# EAGLE schematic USB-C_PURE_v1 (EAGLE 9.7.0)

## Sheet 1 of 2
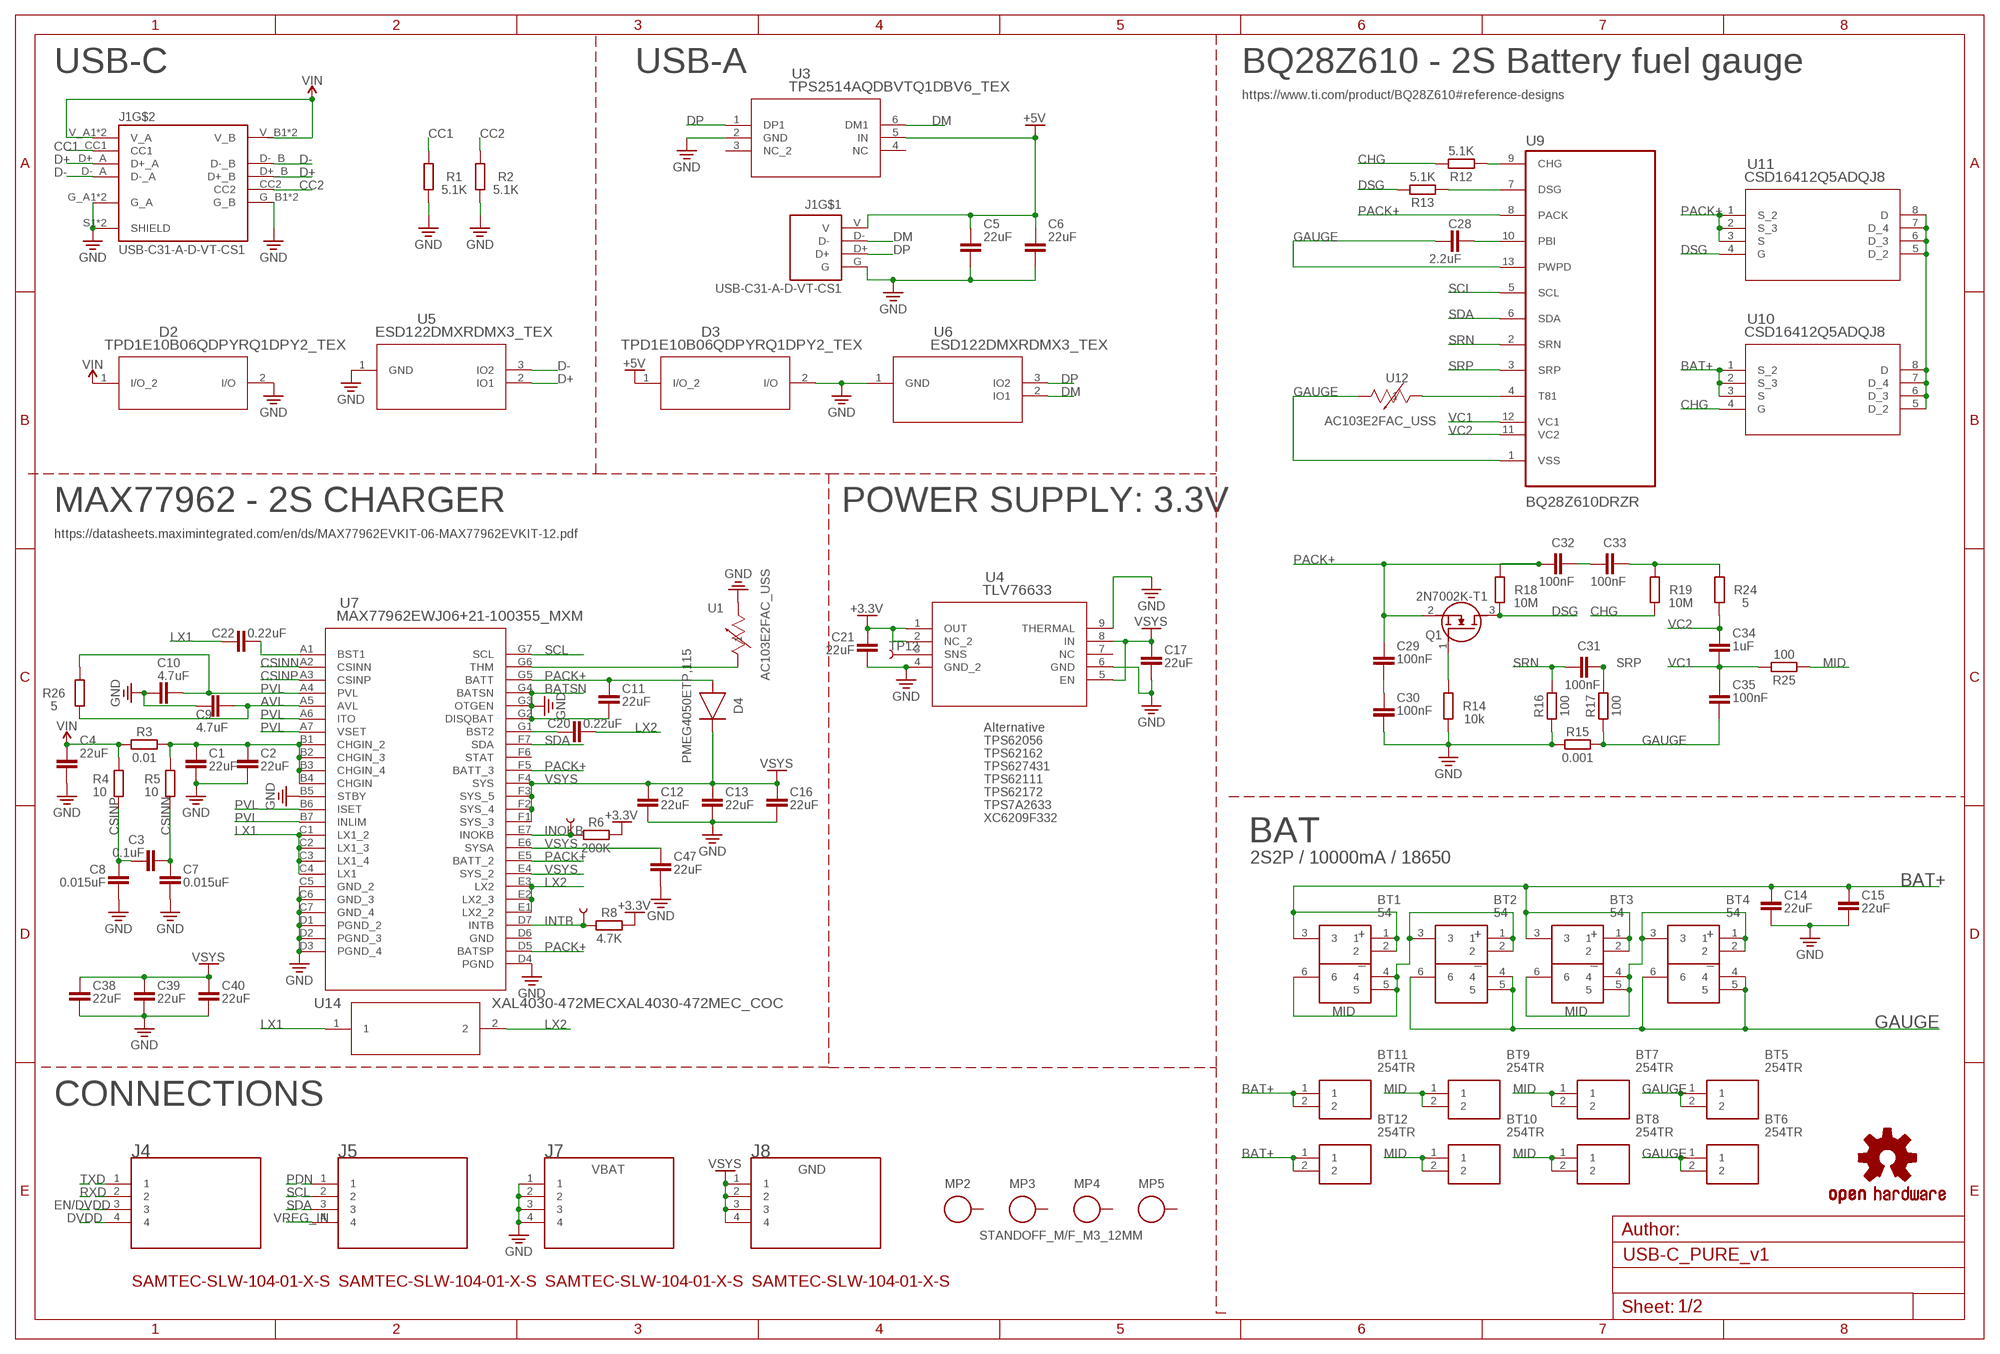
[diagram p0: schematic, sheet 1]

### Parts
BT1  54  [54]
BT2  54  [54]
BT3  54  [54]
BT4  54  [54]
BT5  254TR  [254TR]
BT6  254TR  [254TR]
BT7  254TR  [254TR]
BT8  254TR  [254TR]
BT9  254TR  [254TR]
BT10  254TR  [254TR]
BT11  254TR  [254TR]
BT12  254TR  [254TR]
C1  22uF  C_CHIP-0805(2012-METRIC)  [CAPC2012X110]
C2  22uF  C_CHIP-0805(2012-METRIC)  [CAPC2012X110]
C3  0.1uF  C_CHIP-0603(1608-METRIC)  [CAPC1608X85]
C4  22uF  C_CHIP-0805(2012-METRIC)  [CAPC2012X110]
C5  22uF  C_CHIP-0805(2012-METRIC)  [CAPC2012X110]
C6  22uF  C_CHIP-0805(2012-METRIC)  [CAPC2012X110]
C7  0.015uF  C_CHIP-0603(1608-METRIC)  [CAPC1608X85]
C8  0.015uF  C_CHIP-0603(1608-METRIC)  [CAPC1608X85]
C9  4.7uF  C_CHIP-0603(1608-METRIC)  [CAPC1608X85]
C10  4.7uF  C_CHIP-0603(1608-METRIC)  [CAPC1608X85]
C11  22uF  C_CHIP-0805(2012-METRIC)  [CAPC2012X110]
C12  22uF  C_CHIP-0805(2012-METRIC)  [CAPC2012X110]
C13  22uF  C_CHIP-0805(2012-METRIC)  [CAPC2012X110]
C14  22uF  C_CHIP-0805(2012-METRIC)  [CAPC2012X110]
C15  22uF  C_CHIP-0805(2012-METRIC)  [CAPC2012X110]
C16  22uF  C_CHIP-0805(2012-METRIC)  [CAPC2012X110]
C17  22uF  C_CHIP-0805(2012-METRIC)  [CAPC2012X110]
C20  0.22uF  C_CHIP-0603(1608-METRIC)  [CAPC1608X85]
C21  22uF  C_CHIP-0805(2012-METRIC)  [CAPC2012X110]
C22  0.22uF  C_CHIP-0603(1608-METRIC)  [CAPC1608X85]
C28  2.2uF  C_CHIP-0805(2012-METRIC)  [CAPC2012X110]
C29  100nF  C_CHIP-0402(1005-METRIC)  [CAPC1005X60]
C30  100nF  C_CHIP-0402(1005-METRIC)  [CAPC1005X60]
C31  100nF  C_CHIP-0402(1005-METRIC)  [CAPC1005X60]
C32  100nF  C_CHIP-0402(1005-METRIC)  [CAPC1005X60]
C33  100nF  C_CHIP-0402(1005-METRIC)  [CAPC1005X60]
C34  1uF  C_CHIP-0402(1005-METRIC)  [CAPC1005X60]
C35  100nF  C_CHIP-0402(1005-METRIC)  [CAPC1005X60]
C38  22uF  C_CHIP-0805(2012-METRIC)  [CAPC2012X110]
C39  22uF  C_CHIP-0805(2012-METRIC)  [CAPC2012X110]
C40  22uF  C_CHIP-0805(2012-METRIC)  [CAPC2012X110]
C47  22uF  C_CHIP-0805(2012-METRIC)  [CAPC2012X110]
D2  TPD1E10B06QDPYRQ1DPY2_TEX  [DPY2_TEX]
D3  TPD1E10B06QDPYRQ1DPY2_TEX  [DPY2_TEX]
D4  PMEG4050ETP,115  DIODE_DO-221-AD  [SODFL4725X110]
J1  USB-C31-A-D-VT-CS1  [ADAMTECH_USB-C31-A-D-VT-CS1]
J4  SAMTEC-SLW-104-01-X-SJ  [SAMTEC-SLW-104-01-X-S]
J5  SAMTEC-SLW-104-01-X-SJ  [SAMTEC-SLW-104-01-X-S]
J7  SAMTEC-SLW-104-01-X-SJ  [SAMTEC-SLW-104-01-X-S]
J8  SAMTEC-SLW-104-01-X-SJ  [SAMTEC-SLW-104-01-X-S]
MP2  STANDOFF_M/F_M3_12MM  [STANDOFF_HEX_MALE-FEMALE_550X1200_M3X0.5_MTGP850H320]
MP3  STANDOFF_M/F_M3_12MM  [STANDOFF_HEX_MALE-FEMALE_550X1200_M3X0.5_MTGP850H320]
MP4  STANDOFF_M/F_M3_12MM  [STANDOFF_HEX_MALE-FEMALE_550X1200_M3X0.5_MTGP850H320]
MP5  STANDOFF_M/F_M3_12MM  [STANDOFF_HEX_MALE-FEMALE_550X1200_M3X0.5_MTGP850H320]
Q1  2N7002K-T1  2N7002-7-F  [SOT96P240X120-3N]
R1  5.1K  R_CHIP-0402(1005-METRIC)  [RESC1005X40]
R2  5.1K  R_CHIP-0402(1005-METRIC)  [RESC1005X40]
R3  0.01  R_CHIP-2512(6332-METRIC)  [RESC6332X71]
R4  10  R_CHIP-0603(1608-METRIC)  [RESC1608X60]
R5  10  R_CHIP-0603(1608-METRIC)  [RESC1608X60]
R6  200K  R_CHIP-0603(1608-METRIC)  [RESC1608X60]
R8  4.7K  R_CHIP-0402(1005-METRIC)  [RESC1005X40]
R12  5.1K  R_CHIP-0402(1005-METRIC)  [RESC1005X40]
R13  5.1K  R_CHIP-0402(1005-METRIC)  [RESC1005X40]
R14  10k  R_CHIP-0402(1005-METRIC)  [RESC1005X40]
R15  0.001  R_CHIP-2512(6332-METRIC)  [RESC6332X71]
R16  100  R_CHIP-0603(1608-METRIC)  [RESC1608X60]
R17  100  R_CHIP-0603(1608-METRIC)  [RESC1608X60]
R18  10M  R_CHIP-0402(1005-METRIC)  [RESC1005X40]
R19  10M  R_CHIP-0402(1005-METRIC)  [RESC1005X40]
R24  5  R_CHIP-0402(1005-METRIC)  [RESC1005X40]
R25  100  R_CHIP-0603(1608-METRIC)  [RESC1608X60]
R26  5  R_CHIP-0402(1005-METRIC)  [RESC1005X40]
TP3  TEST-POINT3  [PAD.03X.03]
TP12  TEST-POINT3  [PAD.03X.03]
TP13  TEST-POINT3  [PAD.03X.03]
U1  AC103E2FAC_USS  [AC_USS]
U3  TPS2514AQDBVTQ1DBV6_TEX  [DBV6_TEX]
U4  TLV76633  TLV76650QWDRBRQ1VSON_DRBRQ1_TEX  [VSON_DRBRQ1_TEX]
U5  ESD122DMXRDMX3_TEX  [DMX3_TEX]
U6  ESD122DMXRDMX3_TEX  [DMX3_TEX]
U7  MAX77962EWJ06+21-100355_MXM  [21-100355_MXM]
U9  BQ28Z610DRZR  [IC_BQ27441DRZR-G1A]
U10  CSD16412Q5ADQJ8  [DQJ8]
U11  CSD16412Q5ADQJ8  [DQJ8]
U12  AC103E2FAC_USS  [AC_USS]
U14  XAL4030-472MECXAL4030-472MEC_COC  [XAL4030-472MEC_COC]
U$1  OSHW-LOGOMINI  [OSHW-LOGO-MINI]

### Nets
+3.3V [usbvcc]: C21.1 R6.2 R8.2 U4.1(OUT) U4.2(NC_2) ; also sheet 2
+5V [power]: C5.1 C6.1 D3.1(I/O_2) J1.V U3.5(IN) ; also sheet 2
AVL: C9.1 R26.1 U7.A5(AVL)
BAT+: BT1.1 BT1.2 BT1.3 BT3.1 BT3.2 BT3.3 BT11.1 BT11.2 BT12.1 BT12.2 C14.1 C15.1 U10.1(S_2) U10.2(S_3) U10.3(S)
BATSN: C11.2 U7.G2(DISQBAT) U7.G3(OTGEN) U7.G4(BATSN) ; supply symbol labelled GND
CC1: J1.CC1 R1.2
CC2: J1.CC2 R2.2
CHG: R12.2 R19.1 U10.4(G)
CSINN: C3.2 C7.1 R5.1 U7.A2(CSINN)
CSINP: C3.1 C8.1 R4.1 U7.A3(CSINP)
D+: J1.D+_A J1.D+_B U5.2(IO1) ; also sheet 2
D-: J1.D-_A J1.D-_B U5.3(IO2) ; also sheet 2
DM: J1.D- U3.6(DM1) U6.2(IO1)
DP: J1.D+ U3.1(DP1) U6.3(IO2)
DSG: Q1.3(D) R13.2 R18.1 U11.4(G)
DVDD: J4.4
EN/DVDD: J4.3 ; also sheet 2
GAUGE [gnd]: BT2.4 BT2.5 BT2.6 BT4.4 BT4.5 BT4.6 BT5.1 BT5.2 BT6.1 BT6.2 C28.1 C35.1 R15.2 R17.1 U9.1(VSS) U9.13(PWPD) U12.2
GND [gnd]: C1.2 C2.2 C4.2 C5.2 C6.2 C7.2 C8.2 C9.2 C10.2 C12.2 C13.2 C14.2 C15.2 C16.2 C17.2 C21.2 C30.1 C38.2 C39.2 C40.2 C47.2 D2.2(I/O) D3.2(I/O) J1.G J1.G_A1(G_A) J1.G_A2(G_A) J1.G_B1(G_B) J1.G_B2(G_B) J1.S1(SHIELD) J1.S2(SHIELD) J7.1 J7.2 J7.3 J7.4 R1.1 R2.1 R14.1 R15.1 R16.1 U1.2 U3.2(GND) U4.4(GND_2) U4.6(GND) U4.9(THERMAL) U5.1(GND) U6.1(GND) U7.B5(STBY) U7.C5(GND_2) U7.C6(GND_3) U7.C7(GND_4) U7.D1(PGND_2) U7.D2(PGND_3) U7.D3(PGND_4) U7.D4(PGND) ; also sheet 2
INOKB: R6.1 TP13.P$1 U7.E7(INOKB)
INTB: R8.1 TP3.P$1 U7.D7(INTB) ; also sheet 2
LX1: C22.1 U7.C1(LX1_2) U7.C2(LX1_3) U7.C3(LX1_4) U7.C4(LX1) U14.1
LX2: C20.2 U7.E1(LX2_2) U7.E2(LX2_3) U7.E3(LX2) U14.2
MID: BT1.4 BT1.5 BT1.6 BT2.1 BT2.2 BT2.3 BT3.4 BT3.5 BT3.6 BT4.1 BT4.2 BT4.3 BT7.1 BT7.2 BT8.1 BT8.2 BT9.1 BT9.2 BT10.1 BT10.2 R25.1
N$1: C1.1 C2.1 R3.2 R5.2 U7.B1(CHGIN_2) U7.B2(CHGIN_3) U7.B3(CHGIN_4) U7.B4(CHGIN)
N$2: C28.2 U9.10(PBI)
N$4: U9.4(T81) U12.1
N$8: C20.1 U7.G1(BST2)
N$9: C22.2 U7.A1(BST1)
N$10: U1.1 U7.G6(THM)
N$19: R12.1 U9.9(CHG)
N$20: R13.1 U9.7(DSG)
N$21: C29.1 C30.2
N$23: Q1.1(G) R14.2
N$26: C32.2 C33.1
N$27: U10.5(D_2) U10.6(D_3) U10.7(D_4) U10.8(D) U11.5(D_2) U11.6(D_3) U11.7(D_4) U11.8(D)
N$28: C33.2 R19.2 R24.2
N$34: TP12.P$1 U4.3(SNS)
PACK+: C11.1 C29.2 C32.1 D4.2(A) Q1.2(S) R18.2 U7.D5(BATSP) U7.E5(BATT_2) U7.F5(BATT_3) U7.G5(BATT) U9.8(PACK) U11.1(S_2) U11.2(S_3) U11.3(S)
PDN: J5.1 ; also sheet 2
PVL: C10.1 R26.2 U7.A4(PVL) U7.A6(ITO) U7.A7(VSET) U7.B6(ISET) U7.B7(INLIM)
RXD: J4.2 ; also sheet 2
SCL: J5.2 U7.G7(SCL) U9.5(SCL) ; also sheet 2
SDA: J5.3 U7.F7(SDA) U9.6(SDA) ; also sheet 2
SRN: C31.1 R16.2 U9.2(SRN)
SRP: C31.2 R17.2 U9.3(SRP)
TXD: J4.1 ; also sheet 2
VC1: C34.1 C35.2 R25.2 U9.12(VC1)
VC2: C34.2 R24.1 U9.11(VC2)
VIN [power]: C4.1 D2.1(I/O_2) J1.V_A1(V_A) J1.V_A2(V_A) J1.V_B1(V_B) J1.V_B2(V_B) R3.1 R4.2
VREG_IN: J5.4 ; also sheet 2
VSYS [power]: C12.1 C13.1 C16.1 C17.1 C38.1 C39.1 C40.1 C47.1 D4.1(C) J8.1 J8.2 J8.3 J8.4 U4.5(EN) U4.8(IN) U7.E4(SYS_2) U7.E6(SYSA) U7.F1(SYS_3) U7.F2(SYS_4) U7.F3(SYS_5) U7.F4(SYS) ; also sheet 2
Unconnected: MP2.1 MP3.1 MP4.1 MP5.1 U3.3(NC_2) U3.4(NC) U4.7(NC) U7.F6(STAT)

### Notes on the sheet
- USB-C | USB-A | BQ28Z610 - 2S Battery fuel gauge
- https://www.ti.com/product/BQ28Z610#reference-designs
- MAX77962 - 2S CHARGER | POWER SUPPLY: 3.3V
- https://datasheets.maximintegrated.com/en/ds/MAX77962EVKIT-06-MAX77962EVKIT-12.pdf
- Alternative
- TPS62056
- TPS62162
- TPS627431
- TPS62111
- TPS62172
- TPS7A2633
- XC6209F332
- BAT
- 2S2P / 10000mA / 18650
- CONNECTIONS
- VBAT | GND

## Sheet 2 of 2
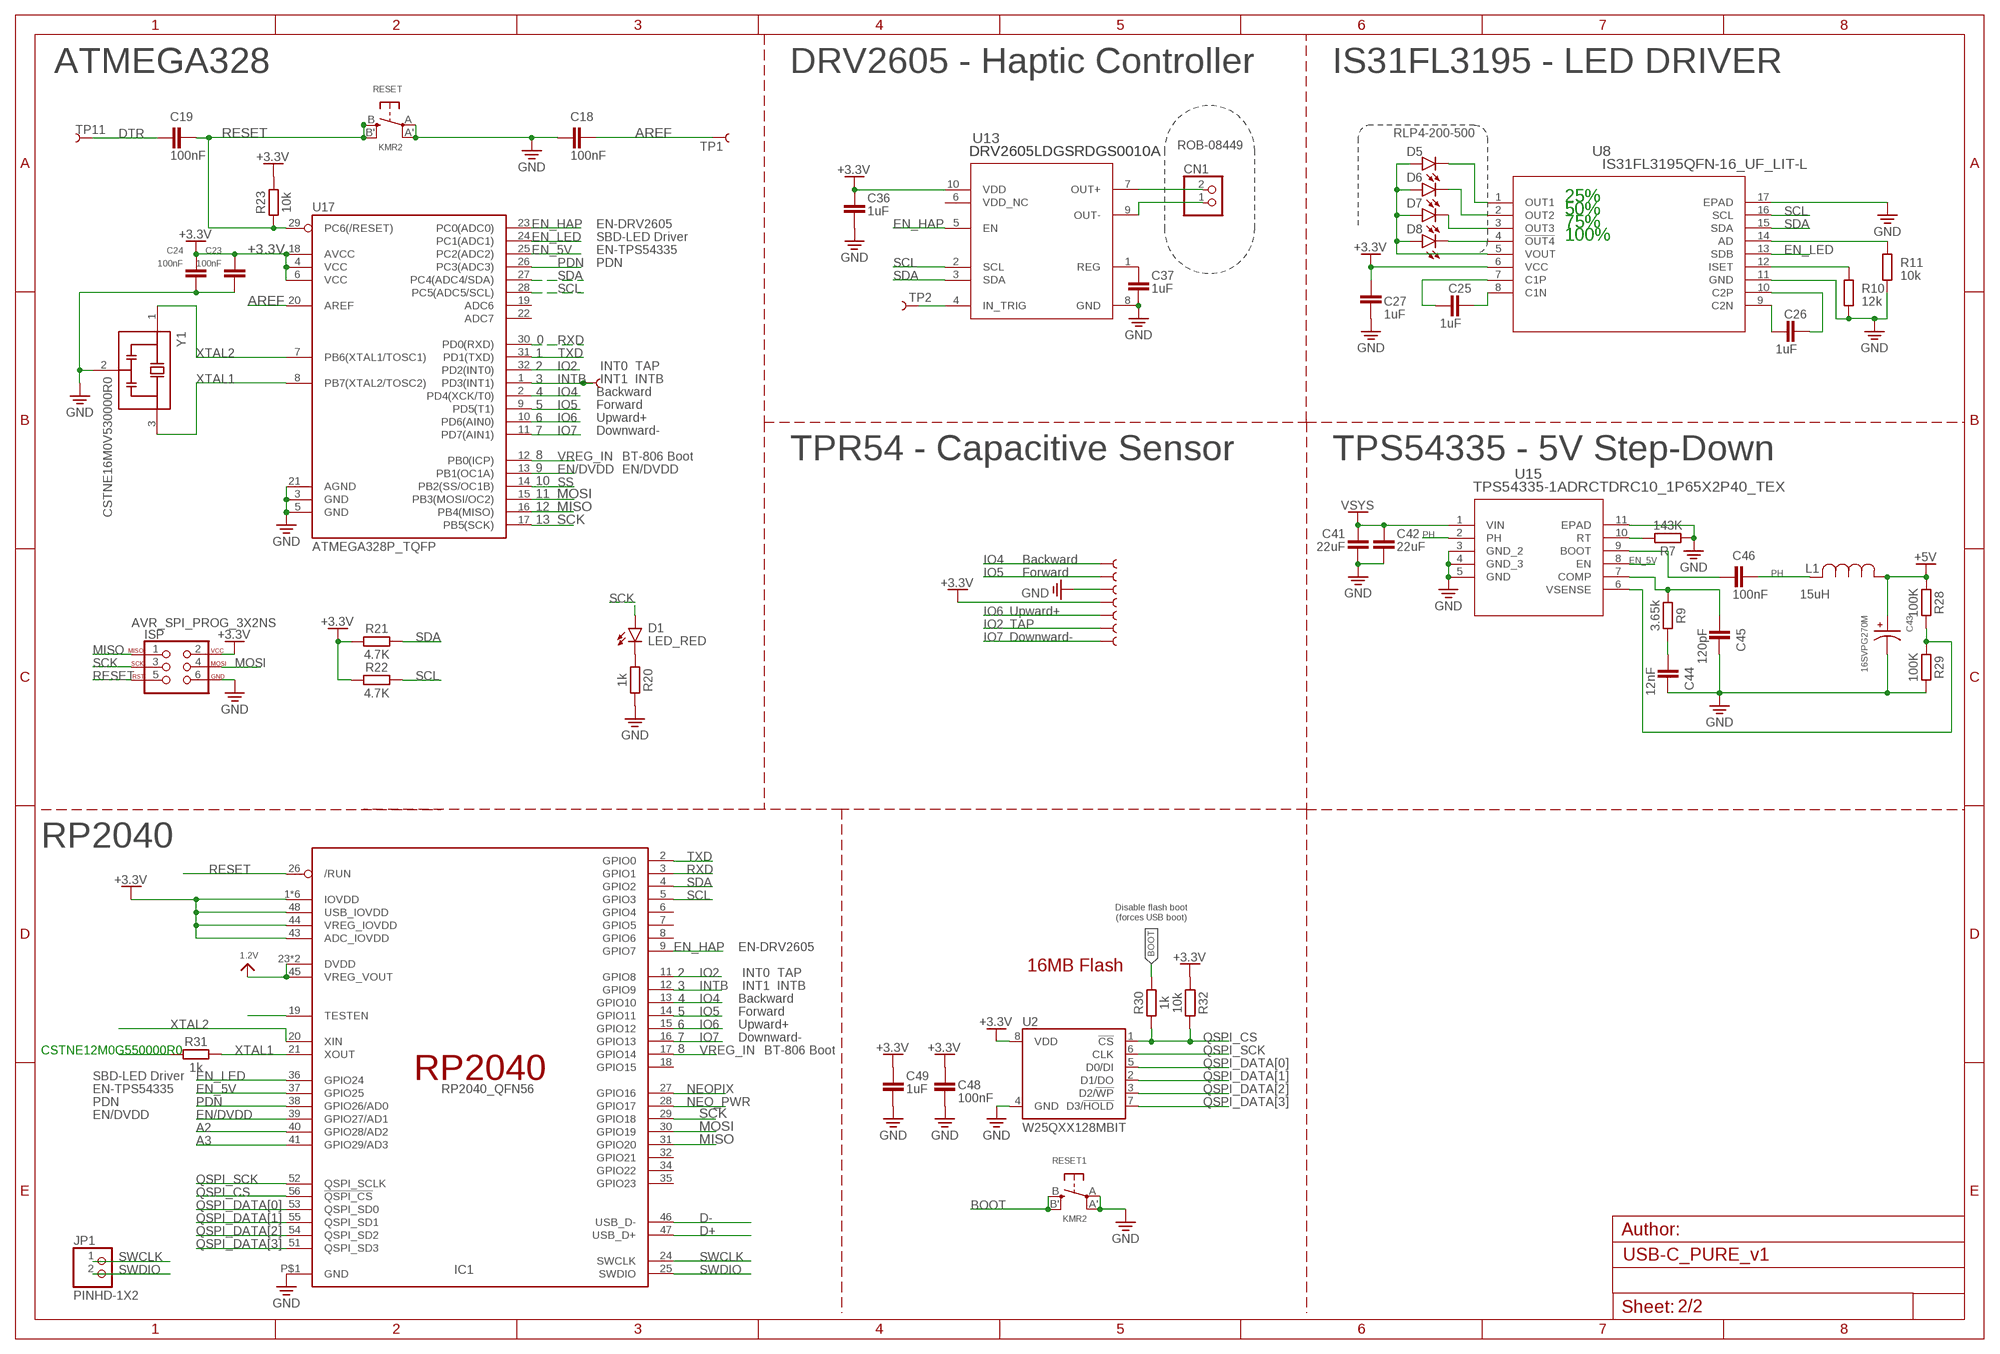
[diagram p1: schematic, sheet 2]

### Parts
C18  100nF  C_CHIP-0402(1005-METRIC)  [CAPC1005X60]
C19  100nF  C_CHIP-0402(1005-METRIC)  [CAPC1005X60]
C23  100nF  C_CHIP-0402(1005-METRIC)  [CAPC1005X60]
C24  100nF  C_CHIP-0402(1005-METRIC)  [CAPC1005X60]
C25  1uF  C_CHIP-0805(2012-METRIC)  [CAPC2012X110]
C26  1uF  C_CHIP-0805(2012-METRIC)  [CAPC2012X110]
C27  1uF  C_CHIP-0805(2012-METRIC)  [CAPC2012X110]
C36  1uF  C_CHIP-0805(2012-METRIC)  [CAPC2012X110]
C37  1uF  C_CHIP-0805(2012-METRIC)  [CAPC2012X110]
C41  22uF  C_CHIP-0805(2012-METRIC)  [CAPC2012X110]
C42  22uF  C_CHIP-0805(2012-METRIC)  [CAPC2012X110]
C43  16SVPG270M  [CAP_16SVPG270M]
C44  12nF  C_CHIP-0402(1005-METRIC)  [CAPC1005X60]
C45  120pF  C_CHIP-0402(1005-METRIC)  [CAPC1005X60]
C46  100nF  C_CHIP-0402(1005-METRIC)  [CAPC1005X60]
C48  100nF  C_CHIP-0402(1005-METRIC)  [CAPC1005X60]
C49  1uF  C_CHIP-0805(2012-METRIC)  [CAPC2012X110]
CN1  JST_2PIN-THM  [JST-PH-2-THM]
D1  LED_RED  CHIP-ROUND-R_0805  [LEDC2012X105N_RND-R]
D5  LED_RED  CHIP-ROUND-R_0805  [LEDC2012X105N_RND-R]
D6  LED_RED  CHIP-ROUND-R_0805  [LEDC2012X105N_RND-R]
D7  LED_RED  CHIP-ROUND-R_0805  [LEDC2012X105N_RND-R]
D8  LED_RED  CHIP-ROUND-R_0805  [LEDC2012X105N_RND-R]
IC1  RP2040_QFN56  [QFN56_7MM_REDUCEDEPAD]
ISP  AVR_SPI_PROG_3X2NS  [2X3-NS]
JP1  PINHD-1X2  [1X02]
L1  15uH  IHLP4040DZER150M11IND_IHLP_4040_DZ_VIS  [IND_IHLP_4040_DZ_VIS]
R7  143K  R_CHIP-0603(1608-METRIC)  [RESC1608X60]
R9  3.65k  R_CHIP-0603(1608-METRIC)  [RESC1608X60]
R10  12k  R_CHIP-0402(1005-METRIC)  [RESC1005X40]
R11  10k  R_CHIP-0402(1005-METRIC)  [RESC1005X40]
R20  1k  R_CHIP-0402(1005-METRIC)  [RESC1005X40]
R21  4.7K  R_CHIP-0402(1005-METRIC)  [RESC1005X40]
R22  4.7K  R_CHIP-0402(1005-METRIC)  [RESC1005X40]
R23  10k  R_CHIP-0402(1005-METRIC)  [RESC1005X40]
R28  100K  R_CHIP-0603(1608-METRIC)  [RESC1608X60]
R29  100K  R_CHIP-0603(1608-METRIC)  [RESC1608X60]
R30  1k  R_CHIP-0402(1005-METRIC)  [RESC1005X40]
R31  1k  R_CHIP-0402(1005-METRIC)  [RESC1005X40]
R32  10k  R_CHIP-0402(1005-METRIC)  [RESC1005X40]
RESET  KMR2  SWITCH_TACT_SMT4.6X2.8  [BTN_KMR2_4.6X2.8]
RESET1  KMR2  SWITCH_TACT_SMT4.6X2.8  [BTN_KMR2_4.6X2.8]
TP1  TEST-POINT3  [PAD.03X.03]
TP2  TEST-POINT3  [PAD.03X.03]
TP4  TEST-POINT3X5  [PAD.03X.05]
TP5  TEST-POINT3X5  [PAD.03X.05]
TP6  TEST-POINT3X5  [PAD.03X.05]
TP7  TEST-POINT3X5  [PAD.03X.05]
TP8  TEST-POINT3X5  [PAD.03X.05]
TP9  TEST-POINT3X5  [PAD.03X.05]
TP10  TEST-POINT3X5  [PAD.03X.05]
TP11  TEST-POINT3  [PAD.03X.03]
TP14  TEST-POINT3  [PAD.03X.03]
U2  W25QXX128MBIT  W25QXX128MBIT-6X5-SKINNY_CENTER  [WSON-8-6X5-SKINNY_CENTERPAD]
U8  IS31FL3195QFN-16_UF_LIT-L  [QFN-16_UF_LIT-L]
U13  DRV2605LDGSRDGS0010A  [DGS0010A]
U15  TPS54335-1ADRCTDRC10_1P65X2P40_TEX  [DRC10_1P65X2P40_TEX]
U17  ATMEGA328P_TQFP  [TQFP32-08]
Y1  CSTNE16M0V530000R0  [OSC_CSTNE16M0V530000R0]

### Nets
1.2V: IC1.23(DVDD) IC1.45(VREG_VOUT) IC1.50(DVDD)
+3.3V [usbvcc]: C23.1 C24.1 C27.2 C36.1 C48.2 C49.1 IC1.1(IOVDD) IC1.10(IOVDD) IC1.22(IOVDD) IC1.33(IOVDD) IC1.42(IOVDD) IC1.43(ADC_IOVDD) IC1.44(VREG_IOVDD) IC1.48(USB_IOVDD) IC1.49(IOVDD) ISP.2 R21.1 R22.1 R23.2 R32.1 TP7.P$1 U2.8(VDD) U8.6(VCC) U13.10(VDD) U17.4(VCC) U17.6(VCC) U17.18(AVCC) ; also sheet 1
+5V [power]: C43.1 L1.1 R28.1 ; also sheet 1
A2: IC1.40(GPIO28/AD2)
A3: IC1.41(GPIO29/AD3)
AREF [aref]: C18.2 TP1.P$1 U17.20(AREF)
BOOT: R30.2 RESET1.B'(S1) RESET1.B(S)
D+: IC1.47(USB_D+) ; also sheet 1
D-: IC1.46(USB_D-) ; also sheet 1
DTR: C19.1 TP11.P$1
EN/DVDD: IC1.39(GPIO27/AD1) U17.13(PB1(OC1A)) ; also sheet 1
EN_5V: IC1.37(GPIO25) U15.8(EN) U17.25(PC2(ADC2))
EN_HAP: IC1.9(GPIO7) U13.5(EN) U17.23(PC0(ADC0))
EN_LED: IC1.36(GPIO24) U8.13(SDB) U17.24(PC1(ADC1))
GND [gnd]: C18.1 C23.2 C24.2 C27.1 C36.2 C37.2 C41.2 C42.2 C43.2 C44.2 C45.2 C48.1 C49.2 IC1.P$1(GND) ISP.6 R7.1 R10.1 R11.1 R20.2 R29.2 RESET1.A'(P1) RESET1.A(P) RESET.A'(P1) RESET.A(P) TP8.P$1 U2.4(GND) U8.11(GND) U8.17(EPAD) U13.8(GND) U15.3(GND_2) U15.4(GND_3) U15.5(GND) U15.11(EPAD) U17.3(GND) U17.5(GND) U17.21(AGND) Y1.2(GND) ; also sheet 1
INTB: IC1.12(GPIO9) TP14.P$1 U17.1(PD3(INT1)) ; also sheet 1
IO2: IC1.11(GPIO8) TP5.P$1 U17.32(PD2(INT0))
IO4: IC1.13(GPIO10) TP10.P$1 U17.2(PD4(XCK/T0))
IO5: IC1.14(GPIO11) TP9.P$1 U17.9(PD5(T1))
IO6: IC1.15(GPIO12) TP6.P$1 U17.10(PD6(AIN0))
IO7: IC1.16(GPIO13) TP4.P$1 U17.11(PD7(AIN1))
MISO: IC1.31(GPIO20) ISP.1 U17.16(PB4(MISO))
MOSI: IC1.30(GPIO19) ISP.4 U17.15(PB3(MOSI/OC2))
N$3: R7.2 U15.10(RT)
N$5: C26.1 U8.9(C2N)
N$6: R10.2 U8.12(ISET)
N$7: C46.1 U15.9(BOOT)
N$11: D5.C U8.1(OUT1)
N$12: D6.C U8.2(OUT2)
N$13: D7.C U8.3(OUT3)
N$14: D8.C U8.4(!OUT4)
N$15: D5.A D6.A D7.A D8.A U8.5(VOUT)
N$16: R11.2 U8.14(AD)
N$17: C25.1 U8.7(C1P)
N$18: C25.2 U8.8(C1N)
N$22: D1.C R20.1
N$24: TP2.P$1 U13.4(IN_TRIG)
N$25: C26.2 U8.10(C2P)
N$29: CN1.2 U13.7(OUT+)
N$30: CN1.1 U13.9(OUT-)
N$31: C37.1 U13.1(REG)
N$32: C44.1 R9.2
N$33: C45.1 R9.1 U15.7(COMP)
N$35: R28.2 R29.1 U15.6(VSENSE)
N$39 [gnd]: IC1.19(TESTEN)
NEO_PWR: IC1.28(GPIO17)
NEOPIX: IC1.27(GPIO16)
PDN: IC1.38(GPIO26/AD0) U17.26(PC3(ADC3)) ; also sheet 1
PH: C46.2 L1.2 U15.2(PH)
QSPI_CS: IC1.56(!QSPI_CS) R30.1 R32.2 U2.1(!CS!)
QSPI_DATA[0]: IC1.53(QSPI_SD0) U2.5(D0/DI)
QSPI_DATA[1]: IC1.55(QSPI_SD1) U2.2(D1/DO)
QSPI_DATA[2]: IC1.54(QSPI_SD2) U2.3(D2/!WP!)
QSPI_DATA[3]: IC1.51(QSPI_SD3) U2.7(D3/!HOLD!)
QSPI_SCK: IC1.52(QSPI_SCLK) U2.6(CLK)
RESET: C19.2 IC1.26(/RUN) ISP.5 R23.1 RESET.B'(S1) RESET.B(S) U17.29(PC6(/RESET))
RXD: IC1.3(GPIO1) U17.30(PD0(RXD)) ; also sheet 1
SCK: D1.A IC1.29(GPIO18) ISP.3 U17.17(PB5(SCK))
SCL: IC1.5(GPIO3) R22.2 U8.16(SCL) U13.2(SCL) U17.28(PC5(ADC5/SCL)) ; also sheet 1
SDA: IC1.4(GPIO2) R21.2 U8.15(SDA) U13.3(SDA) U17.27(PC4(ADC4/SDA)) ; also sheet 1
SS: U17.14(PB2(SS/OC1B))
SWCLK: IC1.24(SWCLK) JP1.1
SWDIO: IC1.25(SWDIO) JP1.2
TXD: IC1.2(GPIO0) U17.31(PD1(TXD)) ; also sheet 1
VREG_IN: IC1.17(GPIO14) U17.12(PB0(ICP)) ; also sheet 1
VSYS [power]: C41.1 C42.1 U15.1(VIN) ; also sheet 1
XTAL1: IC1.21(XOUT) R31.1 R31.2 U17.8(PB7(XTAL2/TOSC2)) Y1.3(OUT)
XTAL2: IC1.20(XIN) U17.7(PB6(XTAL1/TOSC1)) Y1.1(IN)
Unconnected: IC1.6(GPIO4) IC1.7(GPIO5) IC1.8(GPIO6) IC1.18(GPIO15) IC1.32(GPIO21) IC1.34(GPIO22) IC1.35(GPIO23) U17.19(ADC6) U17.22(ADC7)

### Notes on the sheet
- ATMEGA328 | DRV2605 - Haptic Controller | IS31FL3195 - LED DRIVER
- ‎RLP4-200-500‎
- ROB-08449
- 25%
- 50%
- EN-DRV2605 | 75%
- SBD-LED Driver | 100%
- EN-TPS54335
- PDN
- 0
- 1
- 2 | INT0
- TAP
- 3 | INT1
- INTB
- 4
- Backward
- 5
- Forward
- 6
- Upward+
- 7
- Downward-
- 8
- BT-806 Boot | TPR54 - Capacitive Sensor | TPS54335 - 5V Step-Down
- 9
- EN/DVDD
- 10
- 11
- 12
- 13
- Backward
- Forward
- Upward+
- TAP
- Downward-
- RP2040
- Disable flash boot
  (forces USB boot)
- EN-DRV2605
- 16MB Flash
- 2 | INT0
- TAP
- 3 | INT1
- INTB
- 4
- Backward
- 5
- Forward
- 6
- Upward+
- 7
- Downward-
- 8
- CSTNE12M0G550000R0 | BT-806 Boot
- SBD-LED Driver
- EN-TPS54335
- PDN
- EN/DVDD

## Power pins joined to a net without a drawn wire
GND: U7.D6(GND)
VDD_NC: U13.6(VDD_NC)

## Library data of the parts
BT1-BT4 = 54:54: Cylindrical Battery Contacts, Clips, Holders & Springs 16-19mm PC BATTERY CLIP Source: Datasheet <http://www.farnell.com/datasheets/1703960.pdf>; DESCRIPTION: Cylindrical Battery Contacts, Clips, Holders & Springs 16-19mm PC BATTERY CLIP; HEIGHT: mm; MANUFACTURER_NAME: Keystone Electronics; MANUFACTURER_PART_NUMBER: 54; MOUSER_PART_NUMBER: 534-54; MOUSER_PRICE-STOCK: https://www.mouser.co.uk/ProductDetail/Keystone-Electronics/54?qs=73q%2FgRcW4F3NakoJDesViw%3D%3D
BT5-BT12 = 254TR:254TR: Keystone Electronics BATTERY HOLDER ON TAPE AND REEL Source: Datasheet <https://www.keyelco.com/product-pdf.cfm?p=14420>; DESCRIPTION: Keystone Electronics BATTERY HOLDER ON TAPE AND REEL; HEIGHT: 16.97mm; MANUFACTURER_NAME: Keystone Electronics; MANUFACTURER_PART_NUMBER: 254TR; MOUSER_PART_NUMBER: 534-254TR; MOUSER_PRICE-STOCK: https://www.mouser.co.uk/ProductDetail/Keystone-Electronics/254TR?qs=u16ybLDytRapOGIb7D1Ytg%3D%3D
C1-C42 C44-C49 = Capacitor:C: Capacitor - Generic; CATEGORY: Capacitor
C43 = 16SVPG270M:16SVPG270M; MANUFACTURER: Panasonic; MAXIMUM_PACKAGE_HEIGHT: 9.9mm; PARTREV: 05-Mar-21; STANDARD: Manufacturer Recommendations
CN1 = adafruit:JST_2PIN: JST 2-Pin Connectors of various flavors SMT-RA (S2B-PH-SM4) 4UConnector #17311 SMT (B2B-PH-SM4) THM-RA (S2B-PH) THM (B2B-PH)
D1 D5-D8 = LED:CHIP-ROUND-R: LED - Generic; CATEGORY: LED; COLOR: RED; DESCRIPTION: CHIP LED ROUND; SUB-CATEGORY: CHIP; TYPE: ROUND_TOP
D2 D3 = TPD1E10B06QDPYRQ1:TPD1E10B06QDPYRQ1; COPYRIGHT: Copyright (C) 2022 Ultra Librarian. All rights reserved.; DIGI-KEY_PART_NUMBER_1: 296-45327-1-ND; DIGI-KEY_PART_NUMBER_2: 296-45327-2-ND; DIGI-KEY_PART_NUMBER_3: 296-45327-6-ND; DIGI-KEY_PART_NUMBER_4: 296-TPD1E10B06QDPYRQ1CT-ND; DIGI-KEY_PART_NUMBER_5: 296-TPD1E10B06QDPYRQ1DKR-ND; DIGI-KEY_PART_NUMBER_6: 296-TPD1E10B06QDPYRQ1TR-ND; MANUFACTURER_PART_NUMBER: TPD1E10B06QDPYRQ1; MFR_NAME: Texas Instruments
D4 = Diode:DIODE: Diode Rectifier - Generic; CATEGORY: Diode; SUB-CATEGORY: Rectifier; VALUE: DIODE
IC1 = adafruit_micro:RP2040
ISP = SparkFun-Connectors:AVR_SPI_PROG_3X2: AVR ISP 6 Pin This is the reduced ISP connector for AVR programming. Common on Arduino. This footprint will take up less PCB space and can be used with a 10-pin to 6-pin adapter such as SKU: BOB-08508 **Special note about "TEST_POINT" package. The stop mask is on the top side, so if you want your programming test points to be on the bottom of your board, make sure to place this package on the bottom side of the board. This also ensure that the orientation to program from the bottom side will be correct. SparkFun Products: SparkFun ISP Pogo Adapter <https://www.sparkfun.com/products/11591> - NS Tiny AVR Programmer <https://www.sparkfun.com/products/11801> -PTH
J1 = USB-C31-A-D-VT-CS1:USB-C31-A-D-VT-CS1: USB-A (USB TYPE-A) and USB-C (USB TYPE-C), Stacked USB 2.0, USB 3.2 Gen 2 (USB 3.1 Gen 2, Superspeed+ (USB 3.1)) Receptacle Connector 28 Position Through Hole; DESCRIPTION: USB-A (USB TYPE-A) and USB-C (USB TYPE-C), Stacked USB 2.0, USB 3.2 Gen 2 (USB 3.1 Gen 2, Superspeed+ (USB 3.1)) Receptacle Connector 28 Position Through Hole; DIGI-KEY_PART_NUMBER: 2057-USB-C31-A-D-VT-CS1-ND; MF: Adam Tech; MP: USB-C31-A-D-VT-CS1; PACKAGE: None; PURCHASE-URL: https://pricing.snapeda.com/search/part/USB-C31-A-D-VT-CS1/?ref=eda
J4 J5 J7 J8 = SAMTEC-SLW-104-01-X-S:SAMTEC-SLW-104-01-X-S
JP1 = Connector:PINHD-1X2: PIN HEADER; CATEGORY: CONNECTOR; SUB-CATEGORY: PIN-HEADER
L1 = IHLP4040DZER150M11:IHLP4040DZER150M11; COPYRIGHT: Copyright (C) 2022 Ultra Librarian. All rights reserved.; DIGI-KEY_PART_NUMBER_1: 541-1309-1-ND; DIGI-KEY_PART_NUMBER_2: 541-1309-2-ND; DIGI-KEY_PART_NUMBER_3: 541-1309-6-ND; MANUFACTURER_PART_NUMBER: IHLP4040DZER150M11; MFR_NAME: Vishay
MP2-MP5 = PCB-Fasteners_Hardware:STANDOFF_M/F: Male-Male Standoff/Spacer with Mounting pad and hole. Essentra : Male-Female Standoff <https://www.essentracomponents.co.in/index.php?option=com_virtuemart&view=productdetails&virtuemart_product_id=14556> The hole and pad sizes may vary based on the application and type of hardware; always verify the Manufacturer specification or Global Standards.; CATEGORY: Standoff/Spacer; SUB-CATEGORY: Male-Female
Q1 = 2N7002-7-F:2N7002-7-F: MOSFET N-Channel 60V 0.21A SOT23 Diodes Inc 2N7002-7-F N-channel MOSFET Transistor, 0.115 A, 60 V, 3-Pin SOT-23 Source: Datasheet <https://datasheet.datasheetarchive.com/originals/distributors/SFDatasheet-0/sf-0003625.pdf>; ARROW_PART_NUMBER: 2N7002-7-F; ARROW_PRICE-STOCK: https://www.arrow.com/en/products/2n7002-7-f/diodes-incorporated?region=nac; DESCRIPTION: MOSFET N-Channel 60V 0.21A SOT23 Diodes Inc 2N7002-7-F N-channel MOSFET Transistor, 0.115 A, 60 V, 3-Pin SOT-23; HEIGHT: 1.2mm; MANUFACTURER_NAME: Diodes Inc.; MANUFACTURER_PART_NUMBER: 2N7002-7-F; MOUSER_PART_NUMBER: 621-2N7002-F; MOUSER_PRICE-STOCK: https://www.mouser.co.uk/ProductDetail/Diodes-Incorporated/2N7002-7-F?qs=jMXWnm70%252BC%252BAX%252BMLzUkTZg%3D%3D
R1-R26 R28-R32 = Resistor:R: Resistor Fixed - Generic; CATEGORY: Resistor; SUB-CATEGORY: Fixed
RESET RESET1 = microbuilder:SWITCH_TACT_SMT: SMT Tact Switches 6x6mm - Digikey: P12940SCT-ND KMR2 (4.6x2.8mm) - Digikey: 401-1426-1-ND EVQ-PQHB55 - Light Touch, 160GF (4.5x4.5mm) - Digikey: P8090SCT-ND KMT0 - KMT021 NGJ LHS (etc.) IP68/Waterproof - Digikey: CKN10289CT-ND
TP1-TP14 = SparkFun-Connectors:TEST-POINT: SparkFun Test Points Bare copper test points for troubleshooting or In-Circuit-Testing. These are used by our Production team for verifying production board runs using pogo-pins on test beds. SparkFun Products: SparkFun LSM9DS1 Breakout <https://www.sparkfun.com/products/13284> SparkFun PSOC <https://www.sparkfun.com/products/13714> SparkFun Load Cell Amplifier <https://www.sparkfun.com/products/13879>
U1 U12 = 103AT‐2:AC103E2F; COPYRIGHT: Copyright (C) 2022 Ultra Librarian. All rights reserved.; DIGI-KEY_PART_NUMBER_1: 615-1105-ND; MANUFACTURER_PART_NUMBER: AC103E2F; MFR_NAME: US Sensor
U2 = SparkFun-IC-Memory:W25QXX; PROD_ID: IC-15107
U3 = TPS2514AQDBVTQ1:TPS2514AQDBVTQ1; COPYRIGHT: Copyright (C) 2022 Ultra Librarian. All rights reserved.; DIGI-KEY_PART_NUMBER_1: 2156-TPS2514AQDBVTQ1-ND; DIGI-KEY_PART_NUMBER_2: 296-TPS2514AQDBVTQ1CT-ND; DIGI-KEY_PART_NUMBER_3: 296-TPS2514AQDBVTQ1DKR-ND; DIGI-KEY_PART_NUMBER_4: 296-TPS2514AQDBVTQ1TR-ND; DIGI-KEY_PART_NUMBER_5: TPS2514AQDBVTQ1-ND; MANUFACTURER_PART_NUMBER: TPS2514AQDBVTQ1; MFR_NAME: Texas Instruments
U4 = TLV76633:TLV76650QWDRBRQ1; COPYRIGHT: Copyright (C) 2022 Ultra Librarian. All rights reserved.; MANUFACTURER_PART_NUMBER: TLV76650QWDRBRQ1; MFR_NAME: Texas Instruments
U5 U6 = ESD122DMXR:ESD122DMXR; COPYRIGHT: Copyright (C) 2022 Ultra Librarian. All rights reserved.; DIGI-KEY_PART_NUMBER_1: 296-48543-1-ND; DIGI-KEY_PART_NUMBER_2: 296-48543-2-ND; DIGI-KEY_PART_NUMBER_3: 296-48543-6-ND; DIGI-KEY_PART_NUMBER_4: ESD122DMXR-ND; MANUFACTURER_PART_NUMBER: ESD122DMXR; MFR_NAME: Texas Instruments
U7 = MAX77962EWJ06:MAX77962EWJ06+; COPYRIGHT: Copyright (C) 2022 Ultra Librarian. All rights reserved.; MANUFACTURER_PART_NUMBER: MAX77962EWJ06+; MFR_NAME: Maxim Integrated Products
U8 = IS31FL3195:IS31FL3195; COPYRIGHT: Copyright (C) 2022 Ultra Librarian. All rights reserved.; DIGI-KEY_PART_NUMBER_1: LT3518IUF#PBF-CRL-ND; DIGI-KEY_PART_NUMBER_2: LT3518IUF#PBF-ND; MANUFACTURER_PART_NUMBER: LT3518IUF#PBF; MFR_NAME: Analog Devices / Linear Technology
U9 = BQ28Z610DRZR:BQ28Z610DRZR
U10 U11 = CSD16412Q5A:CSD16412Q5A; COPYRIGHT: Copyright (C) 2022 Ultra Librarian. All rights reserved.; DIGI-KEY_PART_NUMBER_1: 296-24256-1-ND; DIGI-KEY_PART_NUMBER_2: 296-24256-2-ND; DIGI-KEY_PART_NUMBER_3: 296-24256-6-ND; DIGI-KEY_PART_NUMBER_4: 2156-CSD16412Q5A-ND; MANUFACTURER_PART_NUMBER: CSD16412Q5A; MFR_NAME: Texas Instruments
U13 = DRV2605LDGSR‎:DRV2605LDGSR; COPYRIGHT: Copyright (C) 2022 Ultra Librarian. All rights reserved.; DIGI-KEY_PART_NUMBER_1: 296-40032-1-ND; DIGI-KEY_PART_NUMBER_2: 296-40032-2-ND; DIGI-KEY_PART_NUMBER_3: 296-40032-6-ND; MANUFACTURER_PART_NUMBER: DRV2605LDGSR; MFR_NAME: Texas Instruments; REFDES: RefDes; TYPE: TYPE
U14 = XAL4030-332MEC:XAL4030-472MEC; COPYRIGHT: Copyright (C) 2022 Ultra Librarian. All rights reserved.; MANUFACTURER_PART_NUMBER: XAL4030-472MEC; MFR_NAME: Coilcraft
U15 = TPS54335:TPS54335-1ADRCT; COPYRIGHT: Copyright (C) 2022 Ultra Librarian. All rights reserved.; DIGI-KEY_PART_NUMBER_1: 296-43174-1-ND; DIGI-KEY_PART_NUMBER_2: 296-43174-2-ND; DIGI-KEY_PART_NUMBER_3: 296-43174-6-ND; MANUFACTURER_PART_NUMBER: TPS54335-1ADRCT; MFR_NAME: Texas Instruments
U17 = SparkFun-IC-Microcontroller:ATMEGA328P_TQFP: Popular 328P in QFP Storefront component: ATmega328 - TQFP <https://www.sparkfun.com/products/13448> (COM-13448) Datasheet <http://www.sparkfun.com/datasheets/Components/SMD/ATMega328.pdf> SparkFun Products SparkFun RedBoard - Programmed with Arduino <https://www.sparkfun.com/products/12757> (DEV-12757) Arduino Pro Mini 328 - 5V/16MHz <https://www.sparkfun.com/products/11113> (DEV-11113) Arduino Pro Mini 328 - 3.3V/8MHz <https://www.sparkfun.com/products/11114> (DEV-11114) SparkFun OpenLog <https://www.sparkfun.com/products/13712> (DEV-13712) SparkFun MicroView - OLED Arduino Module <https://www.sparkfun.com/products/12923> (DEV-12923) SparkFun Digital Sandbox <https://www.sparkfun.com/products/12651> (DEV-12651) SparkFun PicoBoard <https://www.sparkfun.com/products/11888> (WIG-11888) Arduino Fio <https://www.sparkfun.com/products/10116> (DEV-10116) LilyPad Arduino 328 Main Board <https://www.sparkfun.com/products/13342> (DEV-13342) SparkFun RedStick <https://www.sparkfun.com/products/13741> (DEV-13741) LilyPad MP3 <https://www.sparkfun.com/products/11013> (DEV-11013) LilyPad Arduino SimpleSnap <https://www.sparkfun.com/products/10941> (DEV-10941) SparkFun Stepoko <https://www.sparkfun.com/products/13899> (ROB-13899) SparkFun Geiger Counter <https://www.sparkfun.com/products/11345> (SEN-11345) SparkFun EL Sequencer <https://www.sparkfun.com/products/12781> (COM-12781) Arduino Pro 328 - 5V/16MHz <https://www.sparkfun.com/products/10915> (DEV-10915) CryptoCape <https://www.sparkfun.com/products/12773> (DEV-12773) SparkFun IR Thermometer Evaluation Board - MLX90614 <https://www.sparkfun.com/products/10740> (SEN-10740) SparkFun RedBot Mainboard <https://www.sparkfun.com/products/12097> (ROB-12097) Arduino Pro 328 - 3.3V/8MHz <https://www.sparkfun.com/products/10914> (DEV-10914) SparkFun Block for Intel® Edison - Arduino <https://www.sparkfun.com/products/13036> (DEV-13036) SparkFun Simon Says - Surface Mount Soldering Kit <https://www.sparkfun.com/products/10935> (KIT-10935) SparkFun 7-Segment Serial Display - Red <https://www.sparkfun.com/products/11441> (COM-11441) SparkFun 7-Segment Serial Display - White <https://www.sparkfun.com/products/11629> (COM-11629) SparkFun 7-Segment Serial Display - Yellow <https://www.sparkfun.com/products/11443> (COM-11443) SparkFun 7-Segment Serial Display - Kelly Green <https://www.sparkfun.com/products/11440> (COM-11440) SparkFun 7-Segment Serial Display - Blue <https://www.sparkfun.com/products/11442> (COM-11442) SparkFun OpenSegment Serial Display - 20mm (Blue) <https://www.sparkfun.com/products/11647> (COM-11647) SparkFun OpenSegment Serial Display - 20mm (Green) <https://www.sparkfun.com/products/11646> (COM-11646) SparkFun OpenSegment Serial Display - 20mm (White) <https://www.sparkfun.com/products/11648> (COM-11648) SparkFun OpenSegment Serial Display - 20mm (Red) <https://www.sparkfun.com/products/11644> (COM-11644) SparkFun OpenSegment Serial Display - 20mm (Yellow) <https://www.sparkfun.com/products/11645> (COM-11645) SparkFun OpenSegment Shield <https://www.sparkfun.com/products/13190> (DEV-13190); PROD_ID: IC-09069
U$1 = SparkFun-Aesthetics:OSHW-LOGO: Open-Source Hardware (OSHW) Logo This logo indicates the piece of hardware it is found on incorporates a OSHW license and/or adheres to the definition of open source hardware found here: http://freedomdefined.org/OSHW
Y1 = CSTNE16M0V530000R0:CSTNE16M0V530000R0: 16MHz Ceramic Resonator Built in Capacitor 15pF ±0.15% 40 Ohms -40°C ~ 125°C Surface Mount; DESCRIPTION: 16 MHz Ceramic Resonator Built in Capacitor 15 pF ±0.3% 40 Ohms -40°C ~ 85°C Surface Mount; DIGI-KEY_PART_NUMBER: 490-17948-1-ND; MF: Murata Electronics; MP: CSTNE16M0V530000R0; PACKAGE: SMD-3 Murata; PURCHASE-URL: https://pricing.snapeda.com/search/part/CSTNE16M0V530000R0/?ref=eda

## Net classes
1 power: width 0.305 mm
2 gnd: width 0.127 mm, drill 0.483 mm, clearance 0.127 mm
3 usbvcc: width 0.127 mm, drill 0.483 mm, clearance 0.127 mm
4 aref: width 0.127 mm, drill 0.483 mm, clearance 0.127 mm